# EAGLE schematic Prototipo_2.1 (EAGLE 6.1)
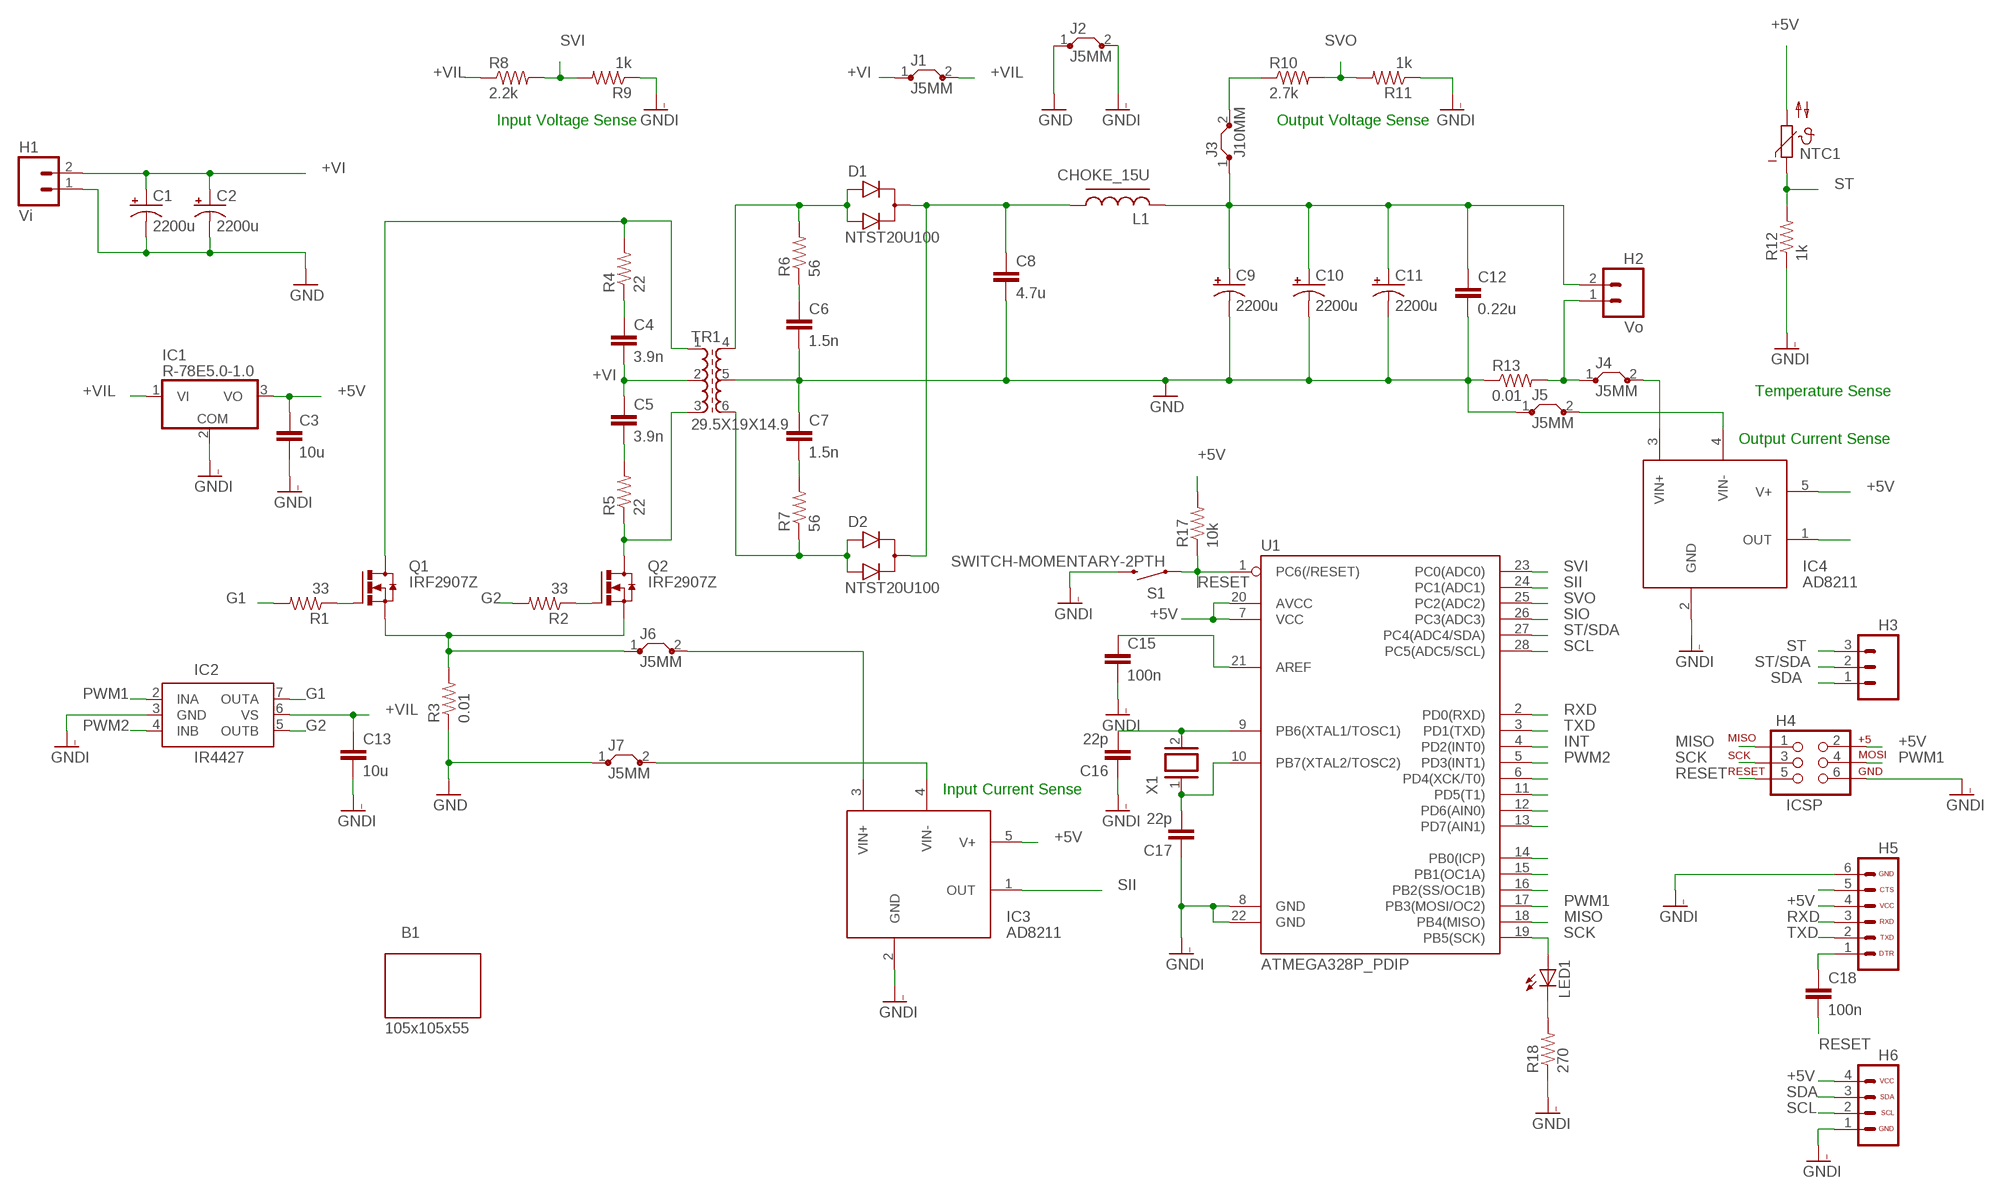
[diagram p0: schematic, sheet 1]

## Parts
B1  105x105x55  BOX_105X105X55  [BOX_105X105X55]
C1  2200u  CPOL_12.5MM_5MM  [CPOL_RADIAL_12.5MM_5MM]
C2  2200u  CPOL_12.5MM_5MM  [CPOL_RADIAL_12.5MM_5MM]
C3  10u  C5/2.5  [C5B2.5]
C4  3.9n  C7.5/3  [C7.5B3]
C5  3.9n  C7.5/3  [C7.5B3]
C6  1.5n  C7.5/3  [C7.5B3]
C7  1.5n  C7.5/3  [C7.5B3]
C8  4.7u  C5/2.5  [C5B2.5]
C9  2200u  CPOL_12.5MM_5MM  [CPOL_RADIAL_12.5MM_5MM]
C10  2200u  CPOL_12.5MM_5MM  [CPOL_RADIAL_12.5MM_5MM]
C11  2200u  CPOL_12.5MM_5MM  [CPOL_RADIAL_12.5MM_5MM]
C12  0.22u  C5/3  [C5B3]
C13  10u  C5/2.5  [C5B2.5]
C15  100n  C5/3  [C5B3]
C16  22p  C5/2.5  [C5B2.5]
C17  22p  C5/2.5  [C5B2.5]
C18  100n  C5/3  [C5B3]
D1  NTST20U100  NTST20U100CTG  [TO220V]
D2  NTST20U100  NTST20U100CTG  [TO220V]
H1  Vi  M025MM  [SCREWTERMINAL-5MM-2]
H2  Vo  M025MM  [SCREWTERMINAL-5MM-2]
H3  M03PTH  [1X03]
H4  ICSP  AVR_SPI_PRG_6PTH  [2X3]
H5  HEADER_SERIAL  [HEADER_SERIAL]
H6  HEADER_I2C  [HEADER_I2C]
IC1  R-78E5.0-1.0  [R-78E5.0-1.0]
IC2  IR4427  [DIL08]
IC3  AD8211  [RJ-5]
IC4  AD8211  [RJ-5]
J1  J5MM  [05]
J2  J5MM  [05]
J3  J10MM  [10]
J4  J5MM  [05]
J5  J5MM  [05]
J6  J5MM  [05]
J7  J5MM  [05]
L1  CHOKE_15U  [CHOKE_15U]
LED1  LED5MM  [LED5MM]
NTC1  NTC640  [P640]
Q1  IRF2907Z  [TO220V]
Q2  IRF2907Z  [TO220V]
R1  33  RESISTORPTH-1/4W  [AXIAL-0.4]
R2  33  RESISTORPTH-1/4W  [AXIAL-0.4]
R3  0.01  RSENSE  [RSENSE]
R4  22  RESISTORPTH-1/2W  [AXIAL-0.5]
R5  22  RESISTORPTH-1/2W  [AXIAL-0.5]
R6  56  RESISTORPTH-1/2W  [AXIAL-0.5]
R7  56  RESISTORPTH-1/2W  [AXIAL-0.5]
R8  2.2k  RESISTORPTH-1/4W  [AXIAL-0.4]
R9  1k  RESISTORPTH-1/4W  [AXIAL-0.4]
R10  2.7k  RESISTORPTH-1/4W  [AXIAL-0.4]
R11  1k  RESISTORPTH-1/4W  [AXIAL-0.4]
R12  1k  RESISTORPTH-1/4W  [AXIAL-0.4]
R13  0.01  RSENSE  [RSENSE]
R17  10k  RESISTORPTH-1/4W  [AXIAL-0.4]
R18  270  RESISTORPTH-1/4W  [AXIAL-0.4]
S1  SWITCH-MOMENTARY-2PTH  [TACTILE-PTH]
TR1  29.5X19X14.9  29.5X19X14.9_N87  [CORE_29.5X19X14.9]
U1  ATMEGA328P_PDIP  [DIL28-3]
X1  XTAL/S  [QS]

## Nets
$N1 [LVHC]: C8.1 D1.2(C) D2.2(C) L1.1
+5V [LVLC]: C3.1 H4.2 H5.4(4_VCC) H6.4(4_VCC) IC1.3(VO) IC3.5(V+) IC4.5(V+) NTC1.2 R17.P$2 U1.7(VCC) U1.20(AVCC)
+VI [LVSHC]: C1.+ C2.+ C4.2 C5.1 H1.2 J1.1 TR1.2
+VIL [LVLC]: C13.1 IC1.1(VI) IC2.6(VS) J1.2 R8.P$1
G1 [LVLC]: IC2.7(OUTA) R1.P$2
G2 [LVLC]: IC2.5(OUTB) R2.P$2
GND [LVHC]: C1.- C2.- C6.2 C7.1 C8.2 C9.- C10.- C11.- C12.2 H1.1 J2.1 J5.1 J7.1 R3.P$1 R13.P$1 TR1.5
GNDI [LVLC]: C3.2 C13.2 C15.2 C16.1 C17.1 H4.6 H5.6(6_GND) H6.1(1_GND) IC1.2(COM) IC2.3(GND) IC3.2(GND) IC4.2(GND) J2.2 R9.P$1 R11.P$1 R12.P$1 R18.P$1 S1.3 U1.8(GND) U1.22(GND)
INT [LVLC]: U1.4(PD2(INT0))
MISO [LVLC]: H4.1 U1.18(PB4(MISO))
N$1 [LVLC]: Q1.1(G) R1.P$1
N$2 [LVLC]: Q2.1(G) R2.P$1
N$3 [LVLC]: C18.1 H5.1(1_DTR)
N$4 [LVHC]: C7.2 R7.P$2
N$5 [LVHC]: C5.2 R5.P$2
N$6 [LVLC]: H5.5(5_CTS)
N$11 [LVLC]: U1.6(PD4(XCK/T0))
N$12 [LVLC]: U1.11(PD5(T1))
N$13 [LVLC]: U1.12(PD6(AIN0))
N$14 [LVLC]: U1.13(PD7(AIN1))
N$15 [LVLC]: U1.14(PB0(ICP))
N$16 [LVLC]: U1.15(PB1(OC1A))
N$17 [LVLC]: U1.16(PB2(SS/OC1B))
N$18 [LVLC]: J3.2 R10.P$1
N$69 [LVHC]: C6.1 R6.P$1
N$70 [LVHC]: D1.1(A1) D1.3(A2) R6.P$2 TR1.4
N$72 [LVHC]: D2.1(A1) D2.3(A2) R7.P$1 TR1.6
N$73 [LVSHC]: C9.+ C10.+ C11.+ C12.1 H2.2 J3.1 L1.2
N$75 [LVHC]: C4.1 R4.P$1
N$77 [LVHC]: Q1.2(D) R4.P$2 TR1.1
N$79 [LVHC]: Q2.2(D) R5.P$1 TR1.3
N$80 [LVSHC]: J6.1 Q1.3(S) Q2.3(S) R3.P$2
N$81 [LVSHC]: H2.1 J4.1 R13.P$2
N$82 [LVLC]: IC4.3(VIN+) J4.2
N$83 [LVLC]: IC4.4(VIN-) J5.2
N$85 [LVLC]: IC3.4(VIN-) J7.2
N$86 [LVLC]: IC3.3(VIN+) J6.2
N$87 [LVLC]: C16.2 U1.9(PB6(XTAL1/TOSC1)) X1.2
N$88 [LVLC]: C17.2 U1.10(PB7(XTAL2/TOSC2)) X1.1
N$90 [LVLC]: LED1.K(C) R18.P$2
N$92 [LVLC]: C15.1 U1.21(AREF)
PWM1 [LVLC]: H4.4 IC2.2(INA) U1.17(PB3(MOSI/OC2))
PWM2 [LVLC]: IC2.4(INB) U1.5(PD3(INT1))
RESET [LVLC]: C18.2 H4.5 R17.P$1 S1.1 U1.1(PC6(/RESET))
RXD [LVLC]: H5.3(3_RXD) U1.2(PD0(RXD))
SCK [LVLC]: H4.3 LED1.A U1.19(PB5(SCK))
SCL [LVLC]: H6.2(2_SCL) U1.28(PC5(ADC5/SCL))
SDA [LVLC]: H3.1 H6.3(3_SDA)
SII [LVLC]: IC3.1(OUT) U1.24(PC1(ADC1))
SIO [LVLC]: IC4.1(OUT) U1.26(PC3(ADC3))
ST [LVLC]: H3.3 NTC1.1 R12.P$2
ST/SDA [LVLC]: H3.2 U1.27(PC4(ADC4/SDA))
SVI [LVLC]: R8.P$2 R9.P$2 U1.23(PC0(ADC0))
SVO [LVLC]: R10.P$2 R11.P$2 U1.25(PC2(ADC2))
TXD [LVLC]: H5.2(2_TXD) U1.3(PD1(TXD))

## Notes on the sheet
- Input Voltage Sense | Output Voltage Sense
- Temperature Sense
- Output Current Sense
- Input Current Sense

## Library data of the parts
B1 = finger_sun:BOX_105X105X55
C1 C2 C9-C11 = finger_sun:CPOL_12.5MM_5MM; MOUSER: 667-EEU-FR1V222L
C3 C13 = capacitor-wima:C: CAPACITOR naming: grid - package width; MOUSER: 810-FK26X7R1C106K
C4 C5 = capacitor-wima:C: CAPACITOR naming: grid - package width; MOUSER: 594-K392K15X7RF53L2
C6 C7 = capacitor-wima:C: CAPACITOR naming: grid - package width; MOUSER: 581-SR151C152KAR
C8 = capacitor-wima:C: CAPACITOR naming: grid - package width; MOUSER: 81-RDEC71H475K2M1H3A
C12 = capacitor-wima:C: CAPACITOR naming: grid - package width; MOUSER: 80-R82DC3220AA60K
C15 C18 = capacitor-wima:C: CAPACITOR naming: grid - package width; MOUSER: 80-R82DC3100AA50J
C16 C17 = capacitor-wima:C: CAPACITOR naming: grid - package width; MOUSER: 140-50N5-220J-RC
D1 D2 = finger_sun:NTST20U100CTG
H1 H2 = SparkFun-Connectors:M02: Header 2 Standard 2-pin 0.1" header. Use with straight break away headers (SKU : PRT-00116), right angle break away headers (PRT-00553), swiss pins (PRT-00743), machine pins (PRT-00117), and female headers (PRT-00115). Molex polarized connector foot print use with SKU : PRT-08233 with associated crimp pins and housings.
H3 = SparkFun-Connectors:M03: Header 3 Standard 3-pin 0.1" header. Use with straight break away headers (SKU : PRT-00116), right angle break away headers (PRT-00553), swiss pins (PRT-00743), machine pins (PRT-00117), and female headers (PRT-00115). Molex polarized connector foot print use with SKU : PRT-08232 with associated crimp pins and housings.
H4 = SparkFun-Connectors:AVR_SPI_PRG_6: AVR ISP 6 Pin This is the reduced ISP connector for AVR programming. Common on Arduino. This footprint will take up less PCB space and can be used with a 10-pin to 6-pin adapter such as SKU: BOB-08508 **Special note about "TEST_POINT" package. The stop mask is on the top side, so if you want your programming test points to be on the bottom of your board, make sure to place this package on the bottom side of the board. This also ensure that the orientation to program from the bottom side will be correct.
H5 = finger_sun:HEADER_SERIAL
H6 = finger_sun:HEADER_I2C
IC1 = finger_sun:R-78E5.0-1.0
IC2 = finger_sun:IR4427
IC3 IC4 = finger_sun:AD8211
J1-J7 = jumper:J: Bridge
L1 = finger_sun:CHOKE_15U; MOUSER: 652-2200LL-150-H-RC
LED1 = adafruit:LED: LED OSRAM: - CHIPLED LG R971, LG N971, LY N971, LG Q971, LY Q971, LO R971, LY R971 LH N974, LH R974 LS Q976, LO Q976, LY Q976 LO Q996 - Hyper CHIPLED LW Q18S LB Q993, LB Q99A, LB R99A - SideLED LS A670, LO A670, LY A670, LG A670, LP A670 LB A673, LV A673, LT A673, LW A673 LH A674 LY A675 LS A676, LA A676, LO A676, LY A676, LW A676 LS A679, LY A679, LG A679 - Hyper Micro SIDELED® LS Y876, LA Y876, LO Y876, LY Y876 LT Y87S - SmartLED LW L88C, LW L88S LB L89C, LB L89S, LG L890 LS L89K, LO L89K, LY L89K LS L896, LA L896, LO L896, LY L896 - TOPLED LS T670, LO T670, LY T670, LG T670, LP T670 LSG T670, LSP T670, LSY T670, LOP T670, LYG T670 LG T671, LOG T671, LSG T671 LB T673, LV T673, LT T673, LW T673 LH T674 LS T676, LA T676, LO T676, LY T676, LB T676, LH T676, LSB T676, LW T676 LB T67C, LV T67C, LT T67C, LS T67K, LO T67K, LY T67K, LW E67C LS E67B, LA E67B, LO E67B, LY E67B, LB E67C, LV E67C, LT E67C LW T67C LS T679, LY T679, LG T679 LS T770, LO T770, LY T770, LG T770, LP T770 LB T773, LV T773, LT T773, LW T773 LH T774 LS E675, LA E675, LY E675, LS T675 LS T776, LA T776, LO T776, LY T776, LB T776 LHGB T686 LT T68C, LB T68C - Hyper Mini TOPLED® LB M676 - Mini TOPLED Santana® LG M470 LS M47K, LO M47K, LY M47K Source: http://www.osram.convergy.de/
NTC1 = ptc-ntc:NTC640: PHILIPS NTC; MOUSER: 594-NTCLE203E3502JB0; OC_FARNELL: unknown; OC_NEWARK: unknown
Q1 Q2 = finger_sun:IRF2907Z
R1 R2 = SparkFun-Passives:RESISTOR: Resistor Basic schematic elements and footprints for 0603, 1206, and PTH resistors.; MOUSER: 660-MF14DCT52R33R0F
R3 R13 = finger_sun:RSENSE: Open Air Sense Resistor - TT Electronics; MOUSER: 5W_66-OAR5R010JLF
R4 R5 = SparkFun-Passives:RESISTOR: Resistor Basic schematic elements and footprints for 0603, 1206, and PTH resistors.; MOUSER: 603-MFR50SFTE52-22R
R6 R7 = SparkFun-Passives:RESISTOR: Resistor Basic schematic elements and footprints for 0603, 1206, and PTH resistors.; MOUSER: 603-MFR50SFTE52-56R
R8 R9 R11 R12 = SparkFun-Passives:RESISTOR: Resistor Basic schematic elements and footprints for 0603, 1206, and PTH resistors.; MOUSER: 660-MF1/4DC1001F
R10 = SparkFun-Passives:RESISTOR: Resistor Basic schematic elements and footprints for 0603, 1206, and PTH resistors.
R17 = SparkFun-Passives:RESISTOR: Resistor Basic schematic elements and footprints for 0603, 1206, and PTH resistors.; MOUSER: 660-MF1/4DC1002F
R18 = SparkFun-Passives:RESISTOR: Resistor Basic schematic elements and footprints for 0603, 1206, and PTH resistors.; MOUSER: 660-MF1/4DC2700F
S1 = SparkFun-Electromechanical:SWITCH-MOMENTARY-2: Various NO switches- pushbuttons, reed, etc; PROD_ID: SWCH-08441
TR1 = finger_sun:29.5X19X14.9_N87
U1 = SparkFun-DigitalIC:ATMEGA328P_PDIP: uC used in the Arduino 32kb flash, 1k EEPROM, 2k SRAM This is the through-hole version of this chip.; MOUSER: 556-ATMEGA328P-PU
X1 = special:XTAL/S: CRYSTAL

## Net classes
0 HVLC: clearance 0.762 mm
1 HVHC: width 0.762 mm, clearance 1.016 mm to class 0, clearance 1.016 mm
2 LVHC: width 2.032 mm, clearance 5.08 mm to class 0, clearance 5.08 mm to class 1
3 LVLC: width 0.381 mm, clearance 1 mm to class 0, clearance 5.08 mm to class 1
4 LVSHC: width 3.048 mm, clearance 4.572 mm to class 0, clearance 4.572 mm to class 1
5 HVMC: width 0.762 mm, clearance 0.762 mm to class 0, clearance 1.27 mm to class 1, clearance 5.08 mm to class 2, clearance 5.08 mm to class 3, clearance 5.08 mm to class 4, clearance 0.889 mm